# Altium project High Frequency Amplifier.PrjPcb
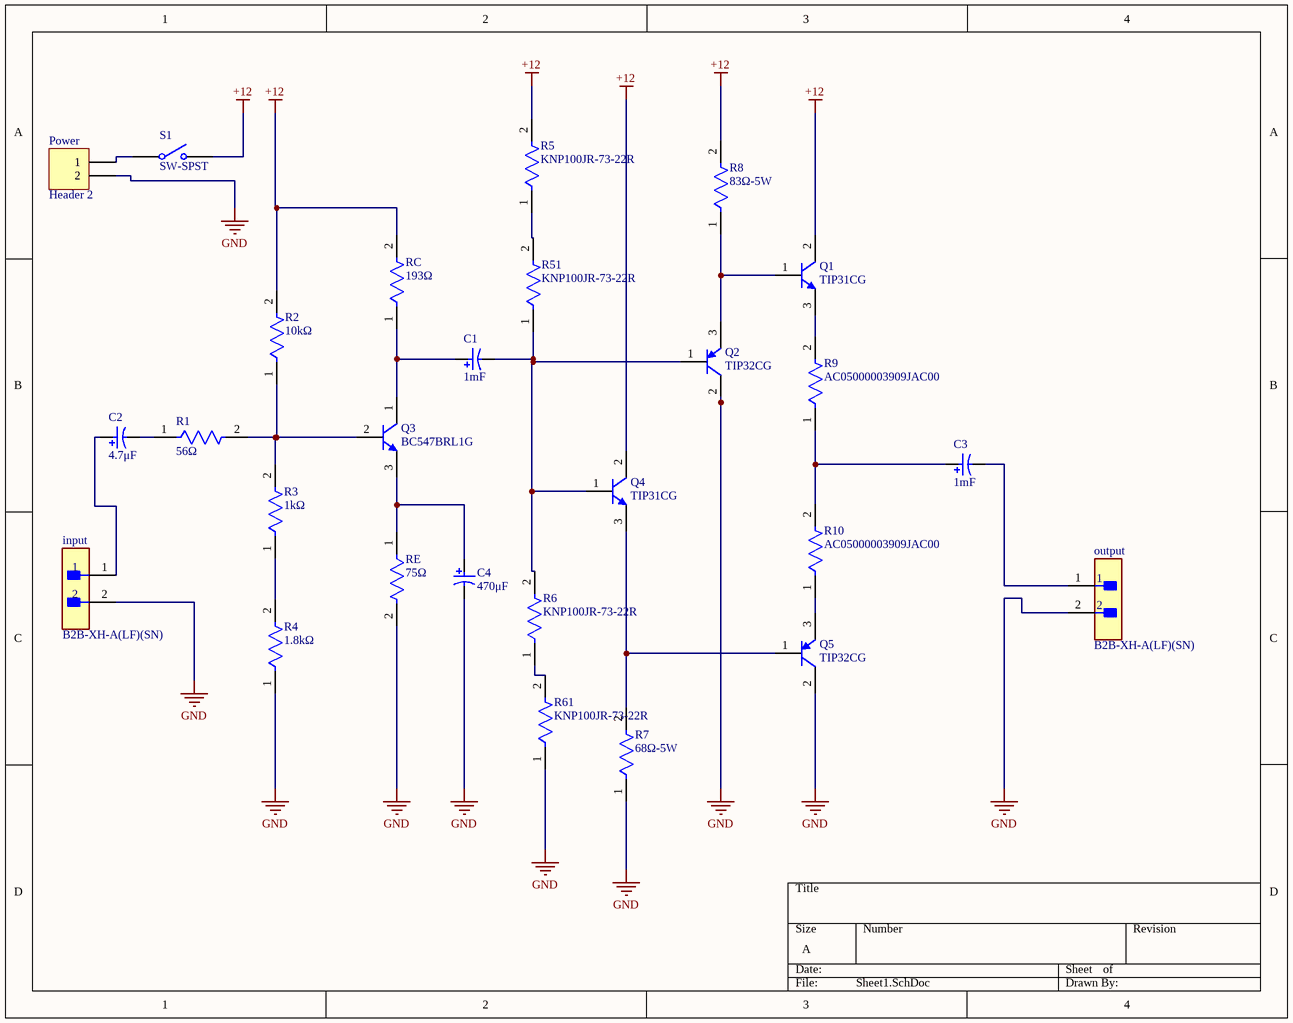
[diagram p0: Sheet1.SchDoc]
1 sheet, 27 parts. Net scope: global (net labels, ports and power ports of the same name join across sheets).
Board file: PCB1.PcbDoc

## Sheet Sheet1.SchDoc
size A; SheetNumber: 1; SheetTotal: 1

### Parts
C1  1mF  [PNSC-EEU-EE2G100-2_V]
C2  4.7μF  [CAPPR55-200-1100X500X1200]
C3  1mF  [PNSC-EEU-EE2G100-2_V]
C4  470μF  [CAPPR55-200-1100X500X1200]
input  B2B-XH-A(LF)(SN)  [FP-B2B-XH-A_LF_SN-MFG]
output  B2B-XH-A(LF)(SN)  [FP-B2B-XH-A_LF_SN-MFG]
Power  Header 2  [HDR1X2]
Q1  TIP31CG  [ONSC-TO-220-3-221A-09]
Q2  TIP32CG  [ONSC-TO-220-3-221A-09]
Q3  BC547BRL1G  [ONSC-TO-92-3-29-11_AM_BL]
Q4  TIP31CG  [ONSC-TO-220-3-221A-09]
Q5  TIP32CG  [ONSC-TO-220-3-221A-09]
R1  56Ω  [FP-MRS25-MFG]
R2  10kΩ  [FP-MRS25-MFG]
R3  1kΩ  [FP-MRS25-MFG]
R4  1.8kΩ  [FP-MRS25-MFG]
R5  KNP100JR-73-22R  [FP-KNP100-MFG]
R6  KNP100JR-73-22R  [FP-KNP100-MFG]
R7  68Ω-5W  [FP-SQP500-MFG]
R8  83Ω-5W  [FP-SQP500-MFG]
R9  AC05000003909JAC00  [FP-AC05000003909JAC00-0]
R10  AC05000003909JAC00  [FP-AC05000003909JAC00-0]
R51  KNP100JR-73-22R  [FP-KNP100-MFG]
R61  KNP100JR-73-22R  [FP-KNP100-MFG]
RC  193Ω  [FP-MRS25-MFG]
RE  75Ω  [FP-MRS25-MFG]
S1  SW-SPST  [SPST-2]

### Nets
+12: Q1.2(C) Q4.2(C) R2.2 R5.2 R8.2 RC.2 S1.2(NO)
GND: C4.2 input.2 output.2 Power.2 Q2.2(C) Q5.2(C) R4.1 R7.1 R61.1 RE.2
NetC1_1: C1.1 Q3.1(C) RC.1
NetC1_2: C1.2 Q2.1(B) Q4.1(B) R6.2 R51.1
NetC2_1: C2.1 input.1
NetC2_2: C2.2 R1.1
NetC3_1: C3.1 R9.1 R10.2
NetC3_2: C3.2 output.1
NetC4_1: C4.1 Q3.3(E) RE.1
NetPower_1: Power.1 S1.1(COMMON)
NetQ1_1: Q1.1(B) Q2.3(E) R8.1
NetQ1_3: Q1.3(E) R9.2
NetQ3_2: Q3.2(B) R1.2 R2.1 R3.2
NetQ4_3: Q4.3(E) Q5.1(B) R7.2
NetQ5_3: Q5.3(E) R10.1
NetR3_1: R3.1 R4.2
NetR5_1: R5.1 R51.2
NetR6_1: R6.1 R61.2

### Library data of the parts
C1 C3 = CMP-0736-00002-1: Aluminum Electrolytic Capacitor, 10 uF +/- 20%, 400 V, -25 to 105 degC, 2-Pin 10 x 10 x 22 mm Through-hole, RoHS, Tape and Reel; PartNumber: EEU-EE2G100; Manufacturer: Panasonic; Ripple Current: 430 mA; Rated Voltage: 400 V; Cap.: 10 uF; Capacitance Tolerance: +/- 20%; ComponentLink2URL: http://industrial.panasonic.com/www-data/pdf/ABA0000/ABA0000CE113.pdf; Mounting Technology: Through Hole; PackageVersion: Nov-12; ComponentLink3URL: http://industrial.panasonic.com/www-data/pdf/ABA0000/ABA0000PE245.pdf; ComponentLink2Description: Datasheet; DatasheetVersion: Nov-12; PackageDescription: 2-Pin Through-hole, Base 10 x 10 mm, Height 22 mm; PackageReference: EEU-EE2G100-2; ComponentLink1URL: http://industrial.panasonic.com/; Temp. Range: -25 to 105 degC; RoHS: TRUE; Packing: Tape and Reel; ComponentLink1Description: Manufacturer URL; ComponentLink3Description: Package Specification
C2 = CMP-1665-00040-2: Aluminum Electrolytic Capacitor, 2.2 uF, +/- 20%, 50 V, -40 to 85 degC, 2-Pin THD, RoHS, Bulk; Manufacturer: Panasonic; Voltage: 50V; Dielectric Material: Aluminium; Ripple Current: 20mA; Leakage Current: 3uA; Life (Hours): 2000Hour; Lead/Base Style: Straight; Dissipation Factor: 0.12%; Lead Diameter: 0.5mm; Capacitance: 2.2uF; Number of Pins: 2; Manufacturer URL: http://www.panasonic.com/; Contact Plating: Tin; Datasheet Version: Rev. 05, 10/2016; RoHSCompliant: true; Height - Seated (Max): 0.472inch; Height: 11mm; Length: 11mm; Termination: Radial; Packaging: Bulk; Case/Package: Radial; Voltage Rating (DC): 50V; Package Quantity: 200; Datasheet URL: https://industrial.panasonic.com/cdbs/www-data/pdf/RDF0000/ABA0000C1218.pdf; Radiation Hardening: No; REACH SVHC: NoSVHC; Max Operating Temperature: 85degC; Voltage Rating: 50V; Mount: ThroughHole; Diameter: 5mm; Lead Pitch: 2mm; Tolerance: 20%; Package Reference: CAPPR55-200-1100X500X1200; Lead Free: LeadFree; Package Description: 2-Pin Radial Lead, Dia 5 mm, Height 12 mm; Min Operating Temperature: -40degC
C4 = CMP-1665-00036-2: Aluminum Electrolytic Capacitor, 22 uF, +/- 20%, 50 V, -40 to 85 degC, 2-Pin THD, RoHS, Bulk; Manufacturer: Panasonic; Ripple Current: 100mA; Life (Hours): 2000Hour; Voltage: 50V; Dissipation Factor: 0.12%; Leakage Current: 3uA; Lead/Base Style: Straight; Capacitance: 22uF; Lead Diameter: 0.5mm; Max Operating Temperature: 85degC; Height: 11mm; Package Reference: CAPPR55-200-1100X500X1200; Radiation Hardening: No; RoHSCompliant: true; Termination: Radial; Case/Package: Radial; REACH SVHC: NoSVHC; Height - Seated (Max): 0.472inch; Min Operating Temperature: -40degC; Packaging: Bulk; Manufacturer URL: http://www.panasonic.com/; Length: 11mm; Tolerance: 20%; Voltage Rating: 50V; Voltage Rating (DC): 50V; Datasheet URL: https://industrial.panasonic.com/cdbs/www-data/pdf/RDF0000/ABA0000C1218.pdf; Lead Pitch: 2mm; Ripple Current (AC): 100mA; Package Description: 2-Pin Radial Lead, Dia 5 mm, Height 12 mm; Diameter: 5mm; Datasheet Version: Rev. 05, 10/2016; Package Quantity: 200; Mount: ThroughHole
input output = CMP-2000-05888-3: CONN HEADER VERT 2POS 2.5MM; Current Rating: 3A; Voltage Rating: 250V; Number of Contacts: 2; Contact Resistance: 20mR; Wire/Cable Gauge: 22AWG; Insulation Resistance: 1GR; Connector Type: Male Pin; Packaging: Bulk; Contact Material: Brass; Lead Free: Lead Free; Orientation: Straight; Contact Plating: Tin; Max Current Rating: 3A; Termination: Solder; Fastening Type: Detent; Depth: 5.75mm; Housing Material: Polyamide; REACH SVHC: No SVHC; Series: XH; Voltage Rating (AC): 250V; Number of Positions: 2; Color: Natural; Contact Type: Male Pin; Max Voltage Rating (DC): 250V; Pitch: 2.5mm; Lead Pitch: 2.5mm; Mount: Through Hole; Max Operating Temperature: 85°C; Length: 7.4mm; Max Voltage Rating (AC): 250V; Min Operating Temperature: -25°C; Number of Rows: 1; Housing Color: White
Power = Header 2: Header, 2-Pin; LatestRevisionDate: 17-Jul-2002; LatestRevisionNote: Re-released for DXP Platform.; Publisher: Altium Limited
Q1 Q4 = CMP-1048-01070-1: Complementary Silicon Plastic Power Transistor, 3-Pin TO-220, Pb-Free, Tube; Manufacturer: On Semiconductor; IC Continuous (A): 3; Polarity: NPN; ComponentLink2URL: http://www.onsemi.com/pub_link/Collateral/TIP31A-D.PDF; ComponentLink3Description: Package Specification; ComponentLink3URL: http://www.onsemi.com/pub_link/Collateral/221A-09.PDF; PackageDescription: 3-Pin Flange Mount, Vertical Straight Lead, Body 9.97 x 4.445 mm, Pitch 2.54 mm; Mounting Technology: Through Hole; PartNumber: TIP31CG; ComponentLink1Description: Manufacturer URL; ComponentLink1URL: http://www.onsemi.com/; RoHS: TRUE; Packing: Tube; PackageReference: TO-220-3-221A-09; ComponentLink2Description: Datasheet; DatasheetVersion: Rev. 14; fT Min (MHz): 3; PackageVersion: Rev. AG, 09/2011
Q2 Q5 = CMP-1048-01068-1: Complementary Silicon Plastic Power Transistor, 3-Pin TO-220, Pb-Free, Tube; Manufacturer: On Semiconductor; Polarity: PNP; IC Continuous (A): 3; ComponentLink3URL: http://www.onsemi.com/pub_link/Collateral/221A-09.PDF; PartNumber: TIP32CG; ComponentLink1Description: Manufacturer URL; DatasheetVersion: Rev. 14; Mounting Technology: Through Hole; ComponentLink2Description: Datasheet; RoHS: TRUE; PackageReference: TO-220-3-221A-09; PackageDescription: 3-Pin Flange Mount, Vertical Straight Lead, Body 9.97 x 4.445 mm, Pitch 2.54 mm; PackageVersion: Rev. AG, 09/2011; fT Min (MHz): 3; Packing: Tube; ComponentLink1URL: http://www.onsemi.com/; ComponentLink3Description: Package Specification; ComponentLink2URL: http://www.onsemi.com/pub_link/Collateral/TIP31A-D.PDF
Q3 = CMP-1048-01605-1: Amplifier Transistor, NPN Silicon, 3-Pin TO-92, Pb-Free, Tape and Reel; Manufacturer: On Semiconductor; IC Continuous (A): 0.1; fT Min (MHz): 150; ComponentLink2URL: http://www.onsemi.com/pub_link/Collateral/BC546-D.PDF; ComponentLink1URL: http://www.onsemi.com/; ComponentLink2Description: Datasheet; RoHS: TRUE; ComponentLink3Description: Package Specification; ComponentLink1Description: Manufacturer URL; ComponentLink3URL: http://www.onsemi.com/pub_link/Collateral/MAC97-D.PDF; PackageDescription: 3-Pin Transistor Outline, Body 4.825 x 3.685 mm, Pitch 1.27 mm; Packing: Tape and Reel; PackageVersion: Rev. AM; Polarity: NPN; DatasheetVersion: Rev. 7; Mounting Technology: Through Hole; PackageReference: TO-92-3-29-11_AM_BL; PartNumber: BC547BRL1G
R1-R4 RC RE = CMP-02408-000003-1: RES 1.1K OHM 0.6W 1% AXIAL; Manufacturer: Vishay BC Components; Manufacturer Part Number: MRS25000C1101FCT00; Voltage Rating: 350V; Resistance: 1.1kΩ; Temperature Coefficient: 50ppm/°C; Value: 1.1kΩ; Device Class L1: Passive Components; Height: 2.5mm; Octopart: https://octopart.com/mrs25000c1101fct00-vishay-43740214; Temperature Range Low: -55°C; Temperature: -55°C to +155°C; Temperature Range High: +155°C; Lead Free: Yes; Mouser Description: Thin Film Resistors .6watt 1.1Kohms 1%; Power Rating: 0.6W; Digikey Description: RES 1.1K OHM 0.6W 1% AXIAL; RoHS: TRUE; Tolerance: 1%; Package: MRS25; Device Class L3: Through-Hole Resistors; ComponentLink2URL: http://www.vishay.com/docs/28724/mrs16m25.pdf; ComponentLink2Description: Datasheet; Composition: Thin Film; Automotive: No; Ipc Land Pattern Name: RESAD1000W75L650D250; Device Class L2: Resistors; Category: Res; Series: MRS25
R5 R6 R51 R61 = CMP-03413-000004-1: RES 22 OHM 1W 5% AXIAL; Manufacturer: Yageo; Value: 22Ω; Description: 22 Ohms ±5% 1W Through Hole Resistor Axial Flame Retardant Coating, Safety Wirewound; Temperature Coefficient: 300ppm/°C; Mouser Description: Wirewound Resistors 22ohm 1W 5%; ComponentLink2Description: Datasheet; Temperature: -40°C to +200°C; Series: KNP; Package: KNP100; Category: Res; ComponentLink2URL: https://www.yageo.com/upload/media/product/products/datasheet/lr/Yageo_LR_KNP_1.pdf; Automotive: No; RoHS: TRUE; Composition: Wirewound; Resistance: 22Ω; Device Class L1: Passive Components; Ipc Land Pattern Name: RESAD1811W100L1250D510; Digikey Description: RES 22 OHM 1W 5% AXIAL; Device Class L2: Resistors; Octopart: https://octopart.com/knp100jr-73-22r-yageo-19031610; Height: 5.1mm; Temperature Range High: +200°C; Temperature Range Low: -40°C; Manufacturer Part Number: KNP100JR-73-22R; Tolerance: 5%; Lead Free: Yes; Power Rating: 1W; Device Class L3: Through-Hole Resistors
R7 R8 = CMP-03413-000003-1: RES 1.2 OHM 5W 5% AXIAL; Manufacturer Part Number: SQP500JB-1R2; Manufacturer: Yageo; Temperature Coefficient: 300ppm/°C; Resistance: 1.2Ω; Value: 1.2Ω; Voltage Rating: 350V; Lead Free: Yes; Package: SQP500; Composition: Wirewound; Series: SQP; Temperature: -55°C to +155°C; Device Class L2: Resistors; Digikey Description: RES 1.2 OHM 5W 5% AXIAL; RoHS: TRUE; Device Class L3: Through-Hole Resistors; ComponentLink2Description: Datasheet; ComponentLink2URL: https://datasheet.ciiva.com/2723/yageolr-sqpnsp-2013-2723111.pdf; Temperature Range High: +155°C; Octopart: https://octopart.com/sqp500jb-1r2-yageo-1162571; Device Class L1: Passive Components; Tolerance: 5%; Height: 10mm; Category: Res; Ipc Land Pattern Name: RESAD2911W100L2350D1050; Automotive: No; Power Rating: 5W; Temperature Range Low: -55°C
R9 R10 = CMP-02408-000001-1: RES 39 OHM 5W 5% AXIAL; Manufacturer: Vishay; Value: 39Ω; Automotive Grade: NA; Device Class L2: Resistors; Automotive: No; Device Class L3: Through-Hole Resistors; Lead Free: Yes; Octopart: https://octopart.com/ac05000003909jac00-vishay-39746279; Tolerance: 5%; Temperature Range High: +250°C; Manufacturer Part Number: AC05000003909JAC00; Power Rating: 5W; Package: 0; Category: Res; Digikey Description: RES 39 OHM 5W 5% AXIAL; RoHS: TRUE; Height: 7.5mm; Mouser Description: Res Wirewound 39 Ohm 5% 5W -80ppm/°C to -10ppm/°C Conformal AXL Thru-Hole Ammo Pack; Resistance: 39Ω; Temperature: -55°C to +250°C; Device Class L1: Passive Components; ComponentLink2URL: http://www.vishay.com/docs/28730/acac-at.pdf; Composition: Wirewound; ComponentLink2Description: Datasheet; Temperature Range Low: -55°C; Series: AC; Ipc Land Pattern Name: RESAD2166W100L1800D750
S1 = SW-SPST: Single-Pole, Single-Throw Switch; Published: 24-Mar-1999; LatestRevisionDate: 17-Jul-2002; LatestRevisionNote: Re-released for DXP Platform.; PackageReference: SPST-2; Publisher: Altium Limited; PackageDescription: Switch; 2 Leads